# EAGLE design host (EAGLE 7.6.0)
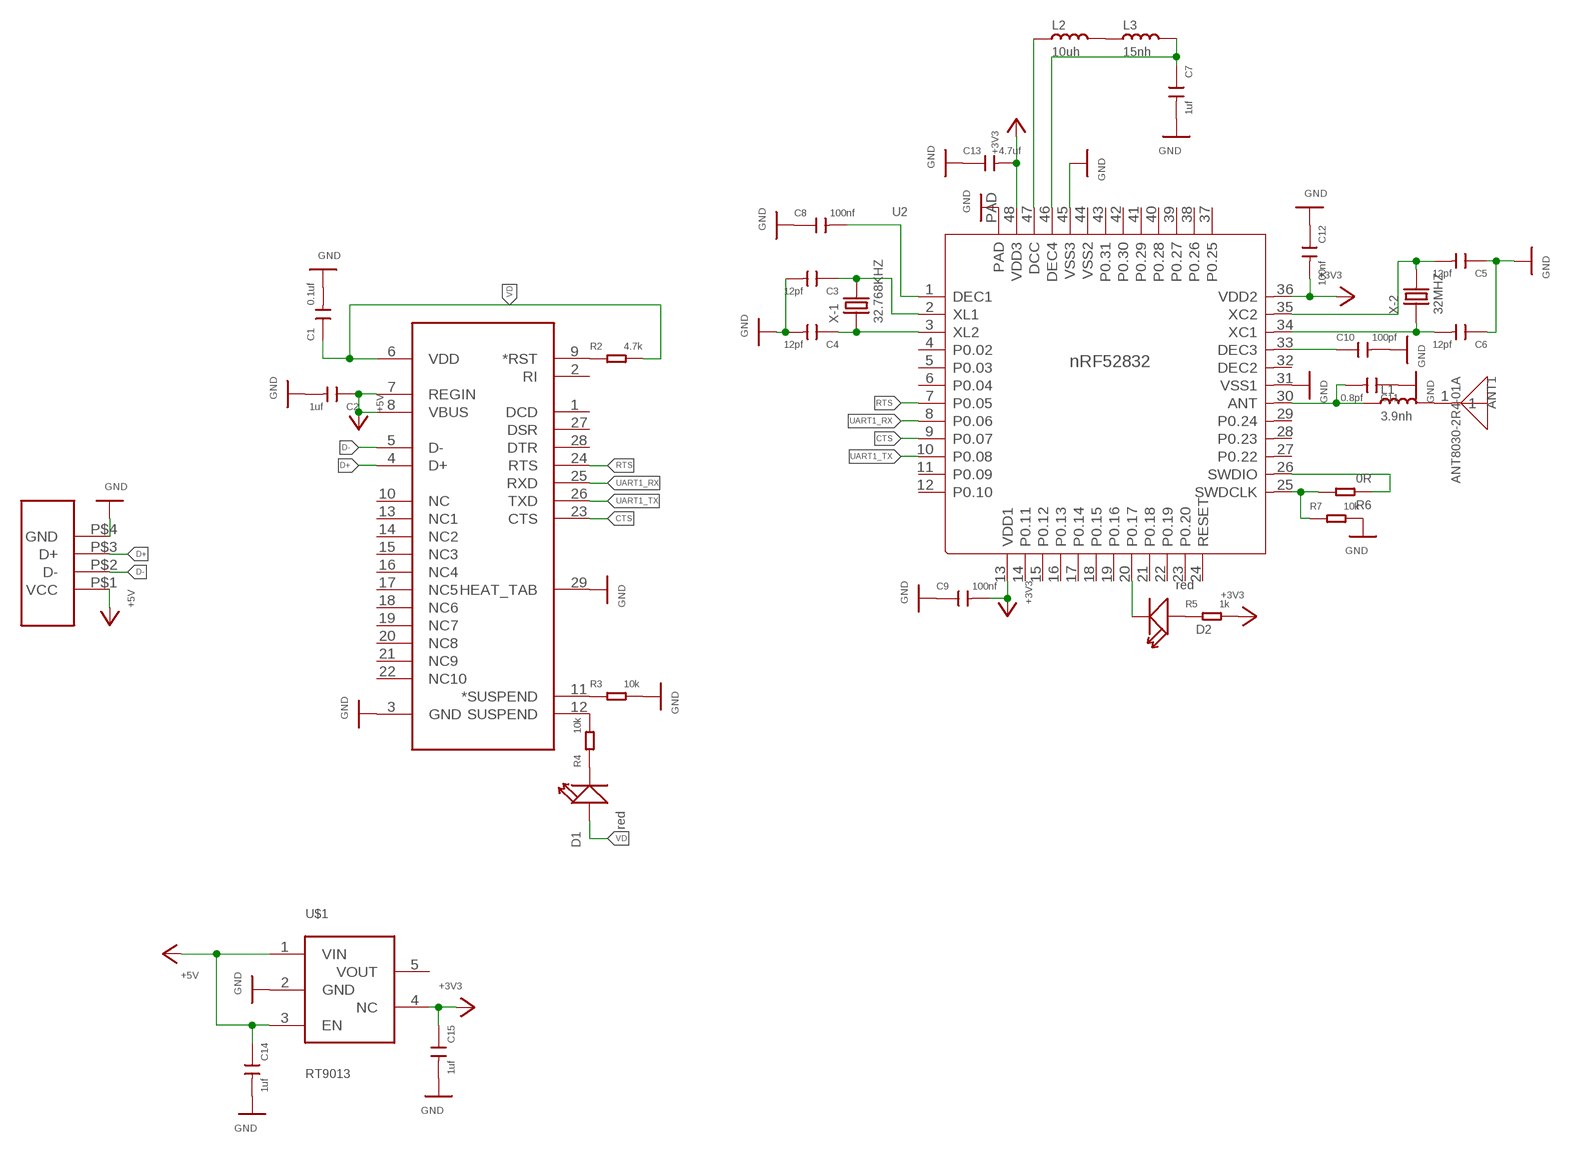
[diagram p0: schematic, sheet 1]

## Parts
ANT1  ANT8030-2R4-01A  ANTENNA  [ANTENNA]
C1  0.1uf  C(0402)  [C0402]
C2  1uf  C(0402)  [C0402]
C3  12pf  C(0402)  [C0402]
C4  12pf  C(0402)  [C0402]
C5  12pf  C(0402)  [C0402]
C6  12pf  C(0402)  [C0402]
C7  1uf  C(0402)  [C0402]
C8  100nf  C(0402)  [C0402]
C9  100nf  C(0402)  [C0402]
C10  100pf  C(0402)  [C0402]
C11  0.8pf  C(0402)  [C0402]
C12  100nf  C(0402)  [C0402]
C13  4.7uf  C(0402)  [C0402]
C14  1uf  C(0402)  [C0402]
C15  1uf  C(0402)  [C0402]
CP1  CP2102  [QFN28G_0.5-5X5MM]
D1  red  LED-(0402)  [LED-0402]
D2  red  LED-(0402)  [LED-0402]
L1  3.9nh  INDUCTOR(0402)  [L0402]
L2  10uh  INDUCTOR(0402)  [L0402]
L3  15nh  INDUCTOR(0402)  [L0402]
R2  4.7k  RES-(0402)  [R0402]
R3  10k  RES-(0402)  [R0402]
R4  10k  RES-(0402)  [R0402]
R5  1k  RES-(0402)  [R0402]
R6  0R  RES-(0603)  [R0603]
R7  10k  RES-(0402)  [R0402]
U1  USB-4PIN  [USB-HW-4PIN]
U2  RF-51822  IC-NRF-52832(QFN48)  [QFN48G-0.4-6X6MM]
U$1  RT9013  [SC-70-5]
X-1  32.768KHZ  [32.768KHZ]
X-2  32MHZ  16MHZ  [16MHZ]

## Nets
+3V3: C9.2 C12.2 C13.2 C15.1 R5.2 U2.13(VDD1) U2.36(VDD2) U2.48(VDD3) U$1.4(NC)
+5V: C2.1 C14.1 CP1.7(REGIN) CP1.8(VBUS) U1.P$1(VCC) U$1.1(VIN) U$1.3(EN)
CTS: CP1.23(CTS) U2.9(P0.07)
D+: CP1.4(D+) U1.P$3(D+)
D-: CP1.5(D-) U1.P$2(D-)
GND: C1.2 C2.2 C3.2 C4.2 C5.1 C6.1 C7.2 C8.1 C9.1 C10.2 C11.1 C12.1 C13.1 C14.2 C15.2 CP1.3(GND) CP1.29(HEAT_TAB) R3.2 R7.2 U1.P$4(GND) U2.31(VSS1) U2.45(VSS3) U2.PAD U$1.2(GND)
N$1: CP1.9(*RST) R2.1
N$2: CP1.11(*SUSPEND) R3.1
N$3: CP1.12(SUSPEND) R4.2
N$5: C8.2 U2.1(DEC1)
N$6: D1.- R4.1
N$7: C3.1 U2.2(XL1) X-1.P$2
N$8: C4.1 U2.3(XL2) X-1.P$1
N$10: D2.+ R5.1
N$11: D2.- U2.20(P0.17)
N$12: R6.2 R7.1 U2.25(SWDCLK)
N$13: R6.1 U2.26(SWDIO)
N$14: ANT1.1 L1.2
N$15: C11.2 L1.1 U2.30(ANT)
N$16: C10.1 U2.33(DEC3)
N$17: C6.2 U2.34(XC1) X-2.1
N$18: C5.2 U2.35(XC2) X-2.3
N$20: L2.2 L3.1
N$21: L2.1 U2.47(DCC)
N$22: C7.1 L3.2 U2.46(DEC4)
RTS: CP1.24(RTS) U2.7(P0.05)
UART1_RX: CP1.25(RXD) U2.8(P0.06)
UART1_TX: CP1.26(TXD) U2.10(P0.08)
VD: C1.1 CP1.6(VDD) D1.+ R2.2
Unconnected: CP1.1(DCD) CP1.2(RI) CP1.10(NC) CP1.13(NC1) CP1.14(NC2) CP1.15(NC3) CP1.16(NC4) CP1.17(NC5) CP1.18(NC6) CP1.19(NC7) CP1.20(NC8) CP1.21(NC9) CP1.22(NC10) CP1.27(DSR) CP1.28(DTR) U2.4(P0.02) U2.5(P0.03) U2.6(P0.04) U2.11(P0.09) U2.12(P0.10) U2.14(P0.11) U2.15(P0.12) U2.16(P0.13) U2.17(P0.14) U2.18(P0.15) U2.19(P0.16) U2.21(P0.18) U2.22(P0.19) U2.23(P0.20) U2.24(RESET) U2.27(P0.22) U2.28(P0.23) U2.29(P0.24) U2.32(DEC2) U2.37(P0.25) U2.38(P0.26) U2.39(P0.27) U2.40(P0.28) U2.41(P0.29) U2.42(P0.30) U2.43(P0.31) U2.44(VSS2) U$1.5(VOUT)

## Library data of the parts
ANT1 = 1-BT4:ANTENNA: 317070006
C1-C15 = 1-BT4:C(0402): 302010048; MPN: CC0402BRNPO9BNR50; VALUE: 0.5pf
CP1 = 1-BT4:CP2102
D1 D2 = 1-BT4:LED-(0402): 304090075; MPN: BL-HB337A-AV-TRB; VALUE: BLUE-0402
L1-L3 = 1-BT4:INDUCTOR(0402): 303010072; VALUE: 1NH-1A
R2-R5 R7 = 1-BT4:RES-(0402): 301010000; MPN: RC0402JR-070RL; VALUE: 0R
R6 = 1-BT4:RES-(0603): 301010236; MPN: RC0603FR-071M1L; VALUE: 1.1M 1/10W
U1 = 1-BT4:USB-4PIN
U2 = 1-BT4:IC-NRF-52832(QFN48): 310060026; MPN: RF-51822
U$1 = 1-BT4:RT9013
X-1 = 1-BT4:32.768KHZ
X-2 = 1-BT4:16MHZ

## Board
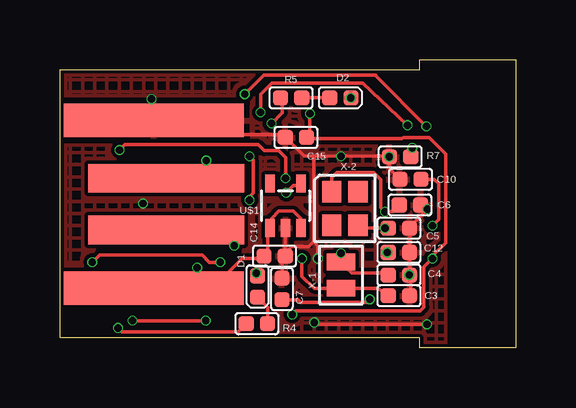
[diagram p1: board, top side]
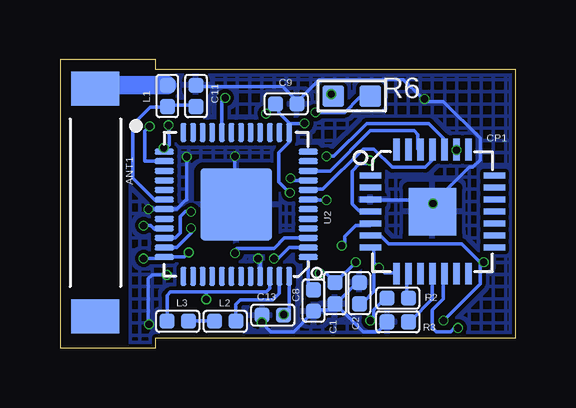
[diagram p2: board, bottom side, seen from below]

Size 19 x 12 mm. Coordinates in mm from the lower left corner, seen from the top.
Outline: 0,0.4 0,11.6 15,11.6 15,12 19,12 19,0 15,0 15,0.4 0,0.4
Copper layers (1*16): Top 0.035mm / dielectric 1.5mm / Bottom 0.035mm
Design rules "default *": minimum track width 6mil, minimum drill 12mil, track to track 6mil, track to pad 6mil, pad to pad 6mil, via to via 6mil, smd to smd 6mil, copper to edge 6mil, drill to drill 8mil, minimum pad ring 10mil, minimum via ring 2mil, stop-mask expansion 4mil, vias tented up to drill 12mil, thermal gap 10mil

### Footprints (pad centres in the part's own frame; a part is rotated, then mirrored left to right if it is on the bottom)
ANTENNA = smd 1.4 x 2: 1 -4.75,0; 2 4.75,0
C0402 = smd 0.635 x 0.635: 1 0,0.445; 2 0,-0.445
QFN28G_0.5-5X5MM = smd 0.9 x 0.254: 1 -2.59,1.5; 2 -2.59,1; 3 -2.59,0.5; 4 -2.59,0; 5 -2.59,-0.5; 6 -2.59,-1; 7 -2.59,-1.5; 15 2.59,-1.5; 16 2.59,-1; 17 2.59,-0.5; 18 2.59,0; 19 2.59,0.5; 20 2.59,1; 21 2.59,1.5 | smd 0.254 x 0.9: 8 -1.5,-2.59; 9 -1,-2.59; 10 -0.5,-2.59; 11 0,-2.59; 12 0.5,-2.59; 13 1,-2.59; 14 1.5,-2.59; 22 1.5,2.59; 23 1,2.59; 24 0.5,2.59; 25 0,2.59; 26 -0.5,2.59; 27 -1,2.59; 28 -1.5,2.59 | smd 1.981 x 1.981: 29 0,0
LED-0402 = smd 0.635 x 0.635: + -0.445,0; - 0.445,0
L0402 = smd 0.635 x 0.635: 1 -0.445,0; 2 0.445,0
R0402 = smd 0.635 x 0.635: 1 0,0.445; 2 0,-0.445
R0603 = smd 0.889 x 0.889: 1 0,0.762; 2 0,-0.762
USB-HW-4PIN = smd 1.4 x 7.5: P$1 0.762,3.81; P$4 7.747,3.81 | smd 1.2 x 6.5: P$2 3.175,3.302; P$3 5.334,3.302
QFN48G-0.4-6X6MM = smd 0.8 x 0.25: 1 -3,2.2; 2 -3,1.8; 3 -3,1.4; 4 -3,1; 5 -3,0.6; 6 -3,0.2; 7 -3,-0.2; 8 -3,-0.6; 9 -3,-1; 10 -3,-1.4; 11 -3,-1.8; 12 -3,-2.2; 25 3,-2.2; 26 3,-1.8; 27 3,-1.4; 28 3,-1; 29 3,-0.6; 30 3,-0.2; 31 3,0.2; 32 3,0.6; 33 3,1; 34 3,1.4; 35 3,1.8; 36 3,2.2 | smd 0.25 x 0.8: 13 -2.2,-3; 14 -1.8,-3; 15 -1.4,-3; 16 -1,-3; 17 -0.6,-3; 18 -0.2,-3; 19 0.2,-3; 20 0.6,-3; 21 1,-3; 22 1.4,-3; 23 1.8,-3; 24 2.2,-3; 37 2.2,3; 38 1.8,3; 39 1.4,3; 40 1,3; 41 0.6,3; 42 0.2,3; 43 -0.2,3; 44 -0.6,3; 45 -1,3; 46 -1.4,3; 47 -1.8,3; 48 -2.2,3 | smd 3 x 3: PAD 0,0
SC-70-5 = smd 0.4 x 0.75: 1 -0.65,-0.925; 2 0,-0.925; 3 0.65,-0.925; 4 0.65,0.925; 5 -0.65,0.925
32.768KHZ = smd 0.7 x 1.2: P$1 -0.55,0; P$2 0.55,0
16MHZ = smd 0.9 x 0.8: 1 0,-1.1; 2 1.4,-1.1; 3 1.4,0; 4 0,0

### Placement (x,y rotation side)
ANT1  17.53,6.05 270 bottom
C1  7.54,2.27 0 bottom
C2  6.53,2.27 180 bottom
C3  14.12,2.16 90 top
C4  14.12,3.03 90 top
C5  14.12,4.98 270 top
C6  14.58,5.95 270 top
C7  9.24,2.44 180 top
C8  8.43,1.96 180 bottom
C9  9.58,10.17 270 bottom
C10  14.6,7.02 270 top
C11  13.33,10.5 0 bottom
C12  14.12,3.97 270 top
C13  10.13,1.35 90 bottom
C14  8.94,3.82 90 top
C15  9.83,8.77 270 top
CP1  3.48,5.67 0 bottom
D1  8.23,2.55 270 top
D2  11.68,10.42 0 top
L1  14.53,10.5 90 bottom
L2  12.12,1.1 180 bottom
L3  14.1,1.1 180 bottom
R2  4.93,2.06 270 bottom
R3  4.93,1.07 270 bottom
R4  8.2,1 270 top
R5  9.63,10.42 270 top
R6  6.84,10.5 90 bottom
R7  14.17,7.96 270 top
U1  7.72,1.73 90 top
U2  11.66,5.97 180 bottom
U$1  9.4,5.92 0 top
X-1  11.71,3.03 270 top
X-2  12.42,6.51 270 top

### Tracks (layer width: path | path; a pad name or v marks a point on that pad's centre or on a via)
+3V3  (via drill 0.3, 0.3 pad 0.41)
  Top 0.152: R5.2 9.27,10.42 9.27,9.81 v8.81,9.35 | C15.1 10.19,8.9 10.46,8.62 | v9.42,6.46 9.73,6.76 10.03,6.76 U$1.4 | v9.68,1.38 9.83,1.53 15.01,1.53 15.16,1.68 15.16,3.36 v15.52,3.71 15.52,3.82 16.08,4.37 16.08,8.08 15.39,8.77 14.3,8.77 14.25,8.72 10.32,8.72 C15.1 | C12.2 v13.64,3.97 | v10.41,9.76 10.41,8.91 C15.1
  Bottom 0.152: 9.42,9.35 9.88,9.81 9.88,10.03 C9.2 9.88,10.11 10.11,10.11 v10.41,9.76 | 9.42,9.35 9.42,9.05 U2.13 | v8.81,9.35 9.42,9.35 | 9.42,9.35 U2.13 | v9.42,6.46 9.88,6.91 9.88,8.13 9.42,8.59 9.42,8.9 U2.13 | v15.52,3.71 14.76,3.71 U2.36 13.83,3.77 v13.64,3.97 | C13.2 v9.68,1.38 9.46,1.6 U2.48
+5V  (via drill 0.3)
  Top 0.152: v5.71,3.33 5.71,2.49 U1.P$1 5.77,3.1 6.98,3.1 7.59,3.71 8.36,3.71 C14.1 8.66,3.87 8.66,4.93 U$1.1 8.81,5.09 8.81,5.39 9.12,5.7 9.73,5.7 10.03,5.39 10.03,5.09 U$1.3
  Bottom 0.152: C2.1 6.53,1.89 6.38,1.89 5.92,2.34 5.92,3.1 5.77,3.26 v5.71,3.33 | CP1.8 5,3.1 5.46,3.1 5.61,3.26 v5.71,3.33 | CP1.7 5.92,4.17 5.92,3.56 5.77,3.41 v5.71,3.33
CTS  (via drill 0.3)
  Top 0.152: v9.4,7.07 9.4,7.93 9.12,8.21 8.51,8.21 8.25,8.46 2.71,8.46 v2.48,8.24
  Bottom 0.152: CP1.23 v2.47,8.24 v2.48,8.24 | U2.9 9.31,6.97 v9.4,7.07
D+  (via drill 0.3)
  Top 0.152: U1.P$3 6.1,7.06 v6.1,7.8
  Bottom 0.152: CP1.4 6.07,5.7 6.53,5.7 6.83,6 6.83,7.37 6.53,7.68 6.22,7.68 v6.1,7.8
D-  (via drill 0.3)
  Top 0.152: U1.P$2 7.26,4.9 v7.26,4.25
  Bottom 0.152: CP1.5 6.07,5.09 6.68,5.09 7.14,4.63 7.14,4.32 v7.26,4.25
GND  (via drill 0.3, 0.3 pad 0.41)
  Top 0.152: U1.P$4 3.81,9.47 v3.81,10.37 | C3.2 14.6,2.19 14.6,2.99 C4.2 | C4.2 14.6,2.95 14.55,3 v14.55,3.03 | 10.54,7.98 v11.71,7.98 13.69,7.98 R7.2 v13.72,7.96 13.72,7.46 C10.2 | 10.54,7.98 10.19,7.98 9.42,8.74 C15.2 9.27,8.9 4.39,8.9 3.94,9.35 U1.P$4 | 3.94,8.9 U1.P$4 | 9.42,3.71 9.27,3.56 9.27,2.95 C7.2 | 9.42,3.71 C14.2 9.38,5 U$1.2 | v10.74,3.71 10.74,4.25 10.57,4.43 | 9.42,3.71 9.42,3.99 9.65,4.22 10.36,4.22 10.57,4.43 | 10.57,4.43 10.57,7.96 10.54,7.98 | C4.2 C12.1 C5.1 14.57,5.02 v15.32,5.77 | C6.1 15.14,5.95 v15.32,5.77 | v15.31,5.77 v15.32,5.77 | v10.59,1.05 10.67,0.97 v15.29,0.97
  Bottom 0.152: CP1.29 3.43,5.67 v3.46,6.01 | C2.2 6.53,2.65 6.68,2.65 7.44,1.89 C1.2 | C11.1 13.23,10.88 9.73,10.88 9.27,10.42 9.27,10.27 C9.1 9.12,10.27 8.2,11.18 4.7,11.18 3.94,10.42 v3.81,10.37 3.78,10.27 3.02,10.27 1.5,8.74 1.5,7.83 1.8,7.52 1.96,7.52 3.33,6.15 CP1.29 | CP1.3 5.92,6.15 3.48,6.15 CP1.29 | v11.71,7.98 11.71,6 U2.PAD | R3.2 5.46,0.97 5.77,0.67 6.38,0.67 7.44,1.73 C1.2 | U2.45 10.66,3.63 v10.74,3.71 | v15.32,5.77 U2.31 14.14,5.77 13.72,6.2 | v13.72,7.96 13.72,6.2 | 13.72,6.2 13.72,6.15 | C13.1 10.49,1.28 10.59,1.17 v10.59,1.05 10.21,0.67 9.27,0.67 8.51,1.43 C8.1 8.36,1.58 7.75,1.58 7.59,1.73 C1.2 | v14.55,3.03 15.16,3.03 15.32,2.88 15.32,1 v15.29,0.97
  pour Bottom (hatched): -0.64,13.19 16.08,13.19 16.08,-1.62 -0.64,-1.62
  pour Top (hatched): -0.97,14.41 16.08,14.41 16.08,-3.83 -0.97,-3.83
N$1
  Bottom 0.152: R2.1 4.55,2.19 4.55,2.95 CP1.9
N$2
  Bottom 0.152: R3.1 4.39,1.12 3.48,2.04 3.48,2.95 CP1.11
N$3  (via drill 0.3)
  Top 0.152: v2.41,0.82 2.57,0.67 7.43,0.67 R4.2
  Bottom 0.152: v2.41,0.82 2.57,0.82 2.72,0.67 3.33,0.67 3.48,0.82 3.48,1.58 3.02,2.04 3.02,2.95 CP1.12
N$5
  Bottom 0.152: C8.2 8.66,2.63 U2.1
N$6
  Top 0.152: D1.- 8.65,1.68 R4.1
N$7  (via drill 0.3 pad 0.41)
  Top 0.152: C3.1 13.26,2.48 X-1.P$2 10.59,2.47 10.08,2.98 v10.08,3.71
  Bottom 0.152: U2.2 9.45,4.17 9.91,3.71 v10.08,3.71
N$8  (via drill 0.3 pad 0.41)
  Top 0.152: C4.1 13.54,3.1 12.17,3.1 11.71,3.56 X-1.P$1 v11.71,3.94
  Bottom 0.152: U2.3 9.65,4.57 10.08,4.15 11.63,4.15 11.71,4.07 v11.71,3.94
N$10
  Top 0.152: D2.+ R5.1
N$11  (via drill 0.3)
  Top 0.152: D2.- v12.12,10.42
  Bottom 0.152: v12.12,10.42 12.26,10.28 U2.20
N$12  (via drill 0.3, 0.3 pad 0.41)
  Top 0.152: v8.36,9.81 8.36,10.57 8.81,11.03 12.62,11.03 v14.48,9.28 | R7.1 arc90 14.68,8.02 v14.68,8.34
  Bottom 0.152: v8.36,9.81 7.14,9.81 6.53,10.42 6.22,10.42 R6.2 | v14.48,9.28 14.45,8.44 14.6,8.29 U2.25 arc90 14.71,8.22 arc-90 14.68,8.25 v14.68,8.34
N$13  (via drill 0.3 pad 0.41)
  Top 0.152: v7.7,10.57 8.48,11.36 13.16,11.36 13.16,11.33 v15.27,9.23
  Bottom 0.152: R6.1 7.68,10.57 v7.7,10.57 | U2.26 15.47,7.78 15.47,9.02 v15.27,9.23
N$14
  Bottom 0.762: L1.2 17.39,10.94 ANT1.1
N$15
  Bottom 0.152: C11.2 13.39,10.11 14.45,10.11 L1.1 | U2.30 14.76,6.15 15.06,6.15 15.98,7.07 15.98,9.3 15.24,10.04 14.54,10.04 L1.1 | 14.6,9.96 L1.1
N$16  (via drill 0.3)
  Top 0.152: C10.1 15.6,7.02 15.77,6.84 15.77,5.34 v15.52,5.09
  Bottom 0.152: v15.52,5.09 15.21,5.09 15.06,4.93 14.76,4.93 U2.33
N$17  (via drill 0.3 pad 0.41)
  Top 0.152: C6.2 13.86,5.67 v13.54,5.67 13.36,5.85 13.36,7.02 13.08,7.3 11.53,7.3 11.32,7.08 X-2.1
  Bottom 0.152: U2.34 14.2,4.57 14,4.78 14,5.47 13.79,5.67 v13.54,5.67
N$18  (via drill 0.3 pad 0.41)
  Top 0.152: C5.2 v13.54,4.98 12.54,4.98 X-2.3
  Bottom 0.152: U2.35 14.14,4.17 13.54,4.78 v13.54,4.98
N$20
  Bottom 0.152: L2.2 12.62,1.12 13.54,1.12 L3.1
N$21
  Bottom 0.152: U2.47 9.86,2.26 10.13,1.99 11.48,1.99 11.67,1.8 L2.1
N$22  (via drill 0.3 pad 0.41)
  Top 0.152: 9.46,1.78 C7.1 9.92,2 10.03,1.89 12.78,1.89 v12.9,2.01
  Bottom 0.152: U2.46 10.26,2.47 10.41,2.32 12.98,2.32 | 12.98,2.32 14.4,2.32 14.54,2.18 L3.2 | v12.9,2.01 12.9,2.24 12.98,2.32
RTS  (via drill 0.3)
  Top 0.152: v7.9,6.15 7.9,6.3 8.05,6.46 8.05,7.83 v7.9,7.98
  Bottom 0.152: v7.9,6.15 8.51,6.15 U2.7 | v7.9,7.98 7.59,7.98 6.22,9.35 3.63,9.35 3.02,8.74 3.02,8.29 CP1.24
UART1_RX
  Bottom 0.152: U2.8 8.51,6.61 8.05,6.61 6.38,8.29 5.92,8.29 5.16,7.52 3.78,7.52 3.48,7.83 3.48,8.13 CP1.25
UART1_TX
  Bottom 0.152: U2.10 8.51,7.37 7.75,7.37 6.07,9.05 4.24,9.05 4.09,8.9 4.09,8.29 CP1.26
VD  (via drill 0.3, 0.3 pad 0.41)
  Top 0.152: v3.02,1.12 v6.07,1.12 | v6.68,3.56 6.22,3.56 5.92,3.87 1.65,3.87 v1.35,3.56 | D1.+ v8.18,3.1
  Bottom 0.152: v6.07,1.12 5.92,1.28 5.92,1.58 5.46,2.04 R2.2 | v3.02,1.12 1.5,2.65 1.5,3.56 | 1.5,3.56 2.26,4.32 5.31,4.32 5.61,4.63 5.92,4.63 CP1.6 | v6.68,3.56 7.44,2.8 C1.1 7.94,3.1 v8.18,3.1 | 1.5,3.56 v1.35,3.56